# Altium project Avionics_Ignition.PrjPcb
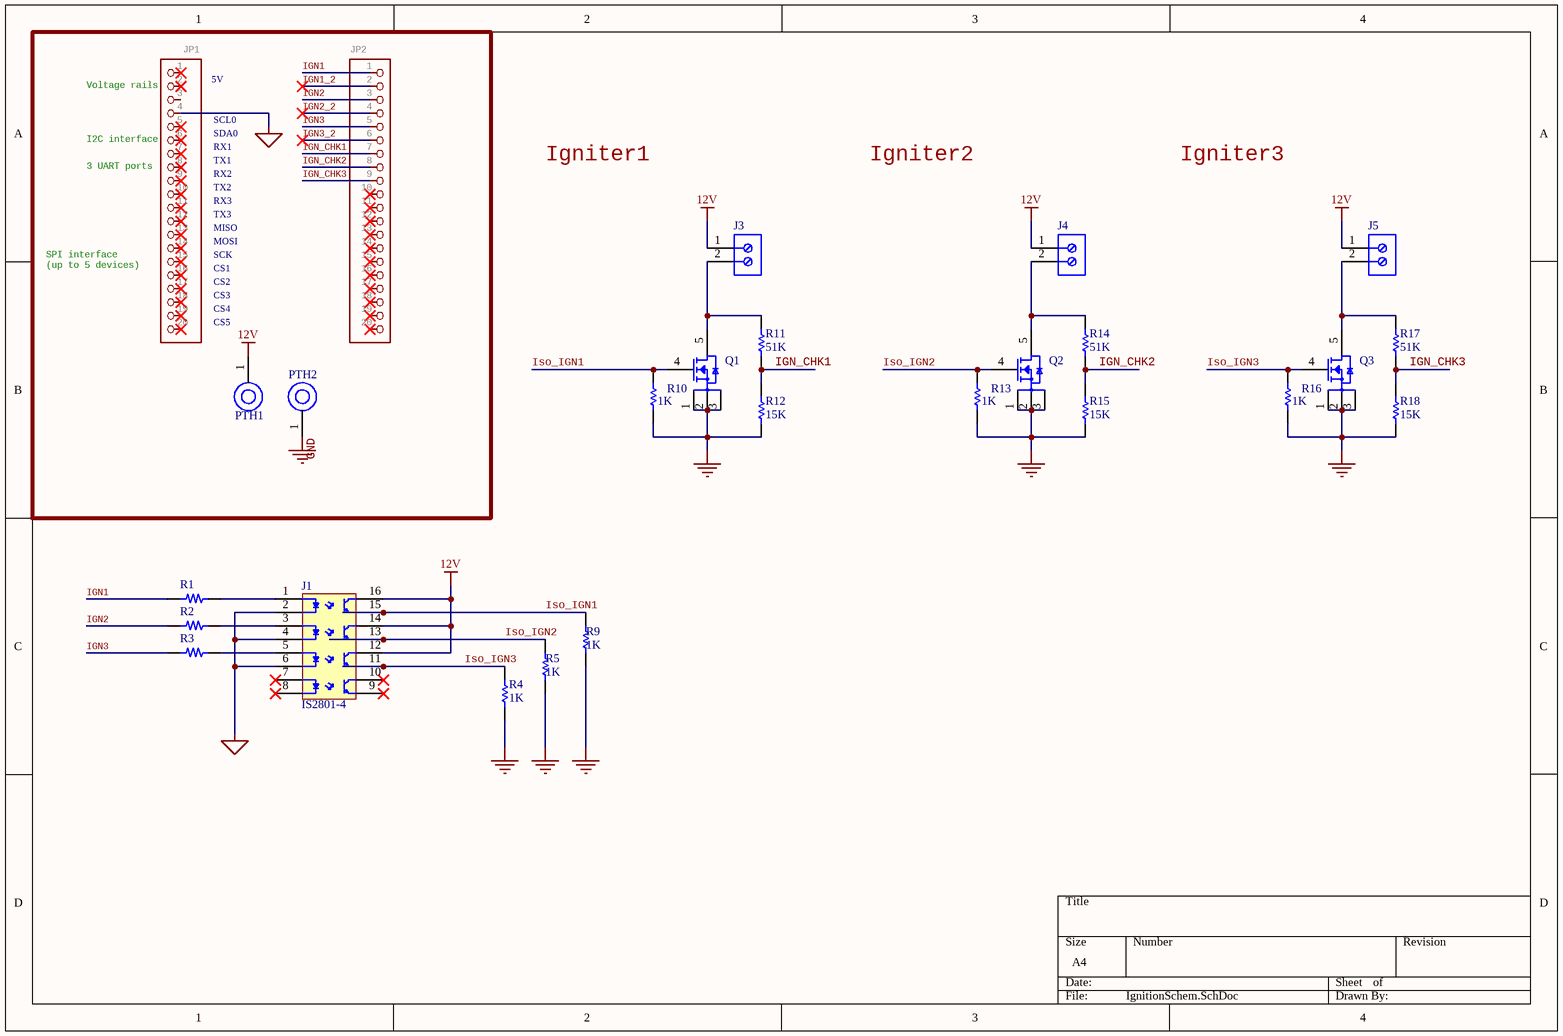
[diagram p0: IgnitionSchem.SchDoc]
1 sheet, 26 parts. Net scope: global (net labels, ports and power ports of the same name join across sheets).
Board file: ignition.PcbDoc

## Sheet IgnitionSchem.SchDoc
size A4

### Parts
J1  IS2801-4  [SOP127P680X220-16N]
J3  1725656  [PHOE-1725656-2]  (value not drawn)
J4  1725656  [PHOE-1725656-2]  (value not drawn)
J5  1725656  [PHOE-1725656-2]  (value not drawn)
JP1  PINHD-1X20  [1X20]  (value not drawn)
JP2  PINHD-1X20  [1X20]  (value not drawn)
PTH1  WIRE_CONNECTOR  [Wire Mount]  (value not drawn)
PTH2  WIRE_CONNECTOR  [Wire Mount]  (value not drawn)
Q1  Ingiter FET  [PSMN5R6-60YLX]  (value not drawn)
Q2  Ingiter FET  [PSMN5R6-60YLX]  (value not drawn)
Q3  Ingiter FET  [PSMN5R6-60YLX]  (value not drawn)
R1  WR06X331JTL  [WR06X331]  (value not drawn)
R2  WR06X331JTL  [WR06X331]  (value not drawn)
R3  WR06X331JTL  [WR06X331]  (value not drawn)
R4  1K  [RESC2013X50X30NL20T20]
R5  1K  [RESC2013X50X30NL20T20]
R9  1K  [RESC2013X50X30NL20T20]
R10  1K  [RESC2013X50X30NL20T20]
R11  51K  [RESC2013X60X35NL10T20]
R12  15K  [RESC0805(2012)_M]
R13  1K  [RESC2013X50X30NL20T20]
R14  51K  [RESC2013X60X35NL10T20]
R15  15K  [RESC0805(2012)_M]
R16  1K  [RESC2013X50X30NL20T20]
R17  51K  [RESC2013X60X35NL10T20]
R18  15K  [RESC0805(2012)_M]

### Nets
12V: J1.12 J1.14 J1.16 J3.1 J4.1 J5.1 PTH1.1
GND: PTH2.1 Q1.1 Q1.2 Q1.3 Q2.1 Q2.2 Q2.3 Q3.1 Q3.2 Q3.3 R4.1 R5.1 R9.1 R10.1 R12.1 R13.1 R15.1 R16.1 R18.1
MCU_GND: J1.2 J1.4 J1.6 JP1.4
IGN1: JP2.1 R1.1
IGN1_2: JP2.2
IGN2: JP2.3 R2.1
IGN2_2: JP2.4
IGN3: JP2.5 R3.1
IGN3_2: JP2.6
IGN_CHK1: JP2.7 R11.1 R12.2
IGN_CHK2: JP2.8 R14.1 R15.2
IGN_CHK3: JP2.9 R17.1 R18.2
Iso_IGN1: J1.15 Q1.4 R9.2 R10.2
Iso_IGN2: J1.13 Q2.4 R5.2 R13.2
Iso_IGN3: J1.11 Q3.4 R4.2 R16.2
NetJ1_1: J1.1 R1.2
NetJ1_3: J1.3 R2.2
NetJ1_5: J1.5 R3.2
NetJ3_2: J3.2 Q1.5 R11.2
NetJ4_2: J4.2 Q2.5 R14.2
NetJ5_2: J5.2 Q3.5 R17.2

Not connected (* = marked no-connect by the designer): J1 7* 8* 9* 10*; JP1 1* 2* 3 5* 6* 7* 8* 9* 10* 11* 12* 13* 14* 15* 16* 17* 18* 19* 20*; JP2 10* 11* 12* 13* 14* 15* 16* 17* 18* 19* 20*

### Notes on the sheet
- (near JP1) Voltage rails
- (near JP1) 5V
- (near JP1) 3 UART ports
- (near JP1) I2C interface
- (near JP1) SCL0
- (near JP1) SDA0
- (near JP1) RX1
- (near JP1) TX1
- (near JP1) RX2
- Igniter1
- Igniter2
- Igniter3
- (near JP1) TX2
- (near JP1) RX3
- (near JP1) TX3
- (near JP1) MISO
- (near JP1) MOSI
- (near JP1) SPI interface
  (up to 5 devices)
- (near JP1) SCK
- (near JP1) CS1
- (near JP1) CS2
- (near JP1) CS3
- CS4
- CS5

### Library data of the parts
J1 = IS2801-4: Optocoupler DC-IN 4-CH Transistor DC-OUT 16-Pin T/R; Manufacturer: Isocom; Number of Channels: 4; Max Output Voltage: 80V; Output Current per Channel: 50mA; Forward Voltage: 1.2V; Collector Emitter Voltage (VCEO): 400mV; Supplier 1: Digi-Key; Supplier Part Number 1: IS2801-4CT-ND; Manufacturer Part Number: IS2801-4; RoHS: Yes; Category: Optocouplers; Stock 1: 23249; Pricing 1: 1=1.63000, 10=1.03000, 100=0.76220, 500=0.70040, 1000=0.57680 (USD); Mount: Surface Mount; Case/Package: SOIC; Number of Pins: 16; Min Operating Temperature: -55°C; Max Operating Temperature: 110°C; Packaging: Tape and Reel; Lead Free: Lead Free; RoHS Compliant: Yes; ComponentLink1URL: https://datasheet.ciiva.com/16495/is2801-4smt-r-16495642.pdf?src-supplier=Future+Electronics; ComponentLink1Description: https://datasheet.ciiva.com/16495/is2801-4smt-r-16495642.pdf?src-supplier=Future+Electronics; ComponentLink2URL: https://datasheet.ciiva.com/29301/156969-da-01-en-optokoppler-is-2801-4-29301144.pdf?src-supplier=Conrad; ComponentLink2Description: https://datasheet.ciiva.com/29301/156969-da-01-en-optokoppler-is-2801-4-29301144.pdf?src-supplier=Conrad
J3-J5 = CMP-2000-05299-1: Male Header, Pitch 2.54 mm, 1 x 2 Position, Height 9 mm, Tail Length 3.5 mm; Manufacturer: Phoenix Contact; Number of contacts: 2; Content: 250pc(s); Pitch: 2.54mm; Industrial packaging: Yes; Colour: Green; Manufacturer part No.: 1725656; Type: MPT0,5/2-2,54; Datasheet URL: http://datasheet.octopart.com/1725656-Phoenix-Contact-datasheet-5302866.pdf; Manufacturer URL: http://www.phoenixcontact.com/; Datasheet Version: Apr-08
JP1 JP2 = PINHD-1X20: PIN HEADER; GateName_1: A; SymbolName_1: PINHD20; LibraryName: adafruit; DeviceSetName: PINHD-1X20
Q1-Q3 = PSMN5R6-60YLX: PSMN5R6-60YL - N-channel 60 V, 5.6 mO logic level MOSFET in LFPAK56; Manufacturer: Nexperia; Supplier 1: Mouser; Supplier Part Number 1: 771-PSMN5R6-60YLX; Manufacturer Part Number: PSMN5R6-60YLX; RoHS: Yes; Category: MOSFETs; Stock 1: 26943; Pricing 1: 1=1.17000, 10=1.05000, 50=1.05000, 100=0.82100, 1000=0.54200, 10000=0.45300 (USD); RoHS Compliant: Yes
R1-R3 = WR06X331JTL: Res Thick Film 0603 330 Ohm 5% 0.1W(1/10W) ±100ppm/C SMD T/R; Manufacturer: Walsin Technologies; Resistance: 330R; Temperature Coefficient: 100ppm/°C; Power Rating: 100mW; Voltage Rating (DC): 75V; Supplier 1: Digi-Key; Supplier Part Number 1: 1292-WR06X331JTLCT-ND; Manufacturer Part Number: WR06X331JTL; RoHS: Yes; Category: Uncategorized; Stock 1: 116752; Pricing 1: 1=0.10000, 10=0.01000, 100=0.00330, 1000=0.00147, 2500=0.00128 (USD); Case/Package: 0603; Contact Material: Tin; Min Operating Temperature: -55°C; Max Operating Temperature: 155°C; Tolerance: 5%; Packaging: Tape and Reel; Working Voltage: 75V; Number of Terminations: 2; Lead Free: Lead Free; RoHS Compliant: Yes; ComponentLink1URL: http://www.farnell.com/datasheets/1960319.pdf?src-supplier=Farnell; ComponentLink1Description: http://www.farnell.com/datasheets/1960319.pdf?src-supplier=Farnell
R4 R5 R9 R10 R13 R16 = CMP-1013-00510-2: Part Number: CRCW08051K00FKEA; Manufacturer: Vishay Dale
R11 = CMP-2001-01389-1: Manufacturer: Yageo; Part Number: RC0805JR-0751KL; Value: 51000 Ohm
R12 R15 R18 = CMP-1013-00102-1: 15K 0.125W 5% 0805 (2012 Metric)  SMD; Case-EIA: 0805; Case-Metric: 2012; Value: 15000.00 Ohm; Power: 0.125 W; Technology: SMT; Tolerance: 5 %
R14 R17 = CMP-2001-01389-1: Manufacturer: Yageo; Part Number: RC0805JR-0751KL